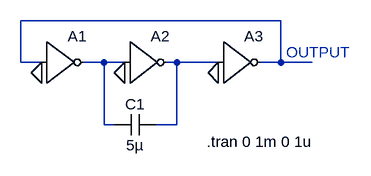
[diagram p0: schematic Code Practice Oscillator.asc]
Code Practice Oscillator.asc, the LTspice schematic file:
Version 4
SHEET 1 1848 680
WIRE 224 -32 -176 -32
WIRE -176 32 -176 -32
WIRE -144 32 -176 32
WIRE -48 32 -80 32
WIRE -16 32 -48 32
WIRE 64 32 48 32
WIRE 128 32 64 32
WIRE 224 32 224 -32
WIRE 224 32 192 32
WIRE 272 32 224 32
WIRE -48 128 -48 32
WIRE -32 128 -48 128
WIRE 64 128 64 32
WIRE 64 128 32 128
FLAG -144 48 0
FLAG -16 48 0
FLAG 128 48 0
SYMBOL Digital\\inv -144 -32 R0
SYMATTR InstName A1
SYMATTR SpiceLine Vhigh=1V,Td=.1m,Trise=.1m
SYMBOL Digital\\inv -16 -32 R0
SYMATTR InstName A2
SYMATTR SpiceLine Vhigh=1V,Td=.1m,Trise=.1m
SYMBOL Digital\\inv 128 -32 R0
SYMATTR InstName A3
SYMATTR SpiceLine Vhigh=1V,Td=.1m,Trise=.1m
SYMBOL cap 32 112 R90
WINDOW 0 0 32 VBottom 2
WINDOW 3 32 32 VTop 2
SYMATTR InstName C1
SYMATTR Value 5µ
TEXT 110 154 Left 2 !.tran 0 1m 0 1u
TEXT 232 16 Left 2 ;OUTPUT

The netlist it stands for:
* Code Practice Oscillator.asc
A1 N001 0 0 0 0 N002 0 0 BUF Vhigh=1V,Td=.1m,Trise=.1m
A2 N002 0 0 0 0 N003 0 0 BUF Vhigh=1V,Td=.1m,Trise=.1m
A3 N003 0 0 0 0 N001 0 0 BUF Vhigh=1V,Td=.1m,Trise=.1m
C1 N003 N002 5µ
.tran 0 1m 0 1u
* OUTPUT
.backanno
.end